# Altium schematic sheet TSAL.SchDoc
size A4; SheetNumber: 9; SheetTotal: 11
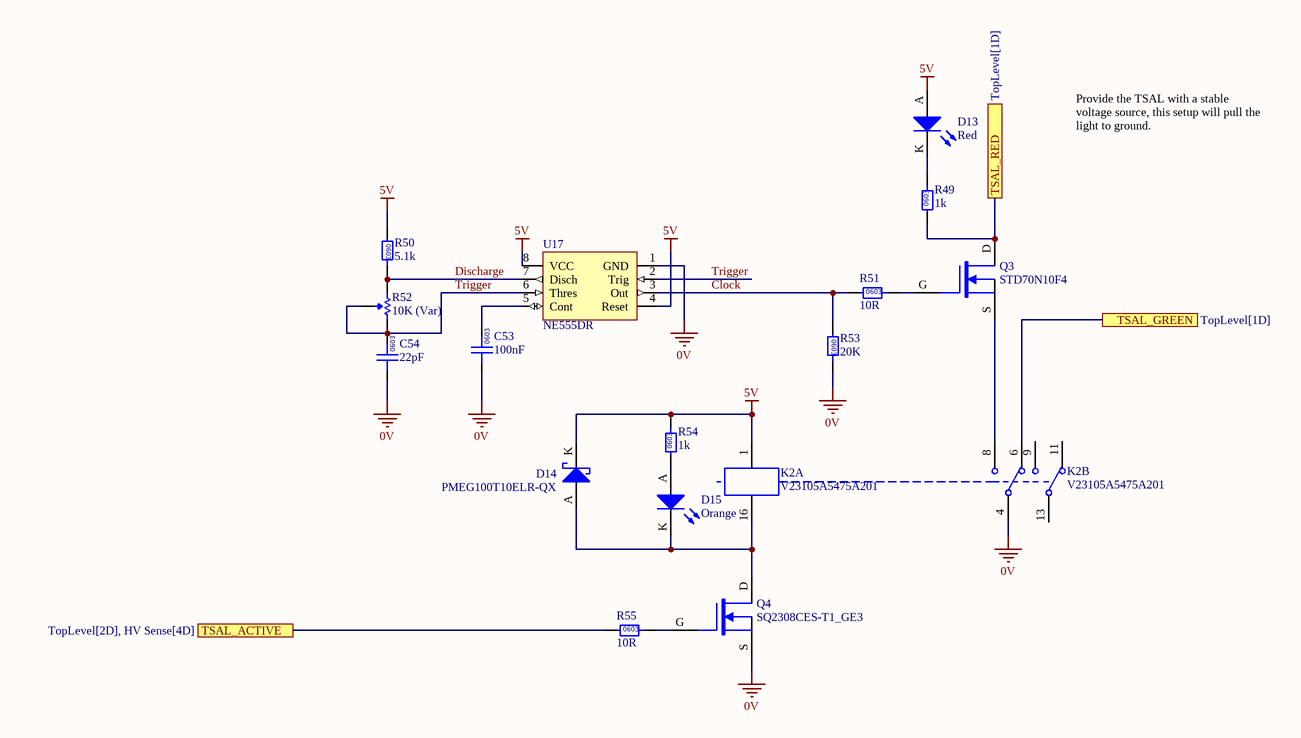
[diagram p0: TSAL.SchDoc]

## Parts
C53  100nF  [0603]
C54  22pF  [0603]
D13  Red  [0805 LED]
D14  PMEG100T10ELR-QX  [NXP SOD123W]
D15  Orange  [0805 LED]
K2  V23105A5475A201  [TI 2-DIL]  (parts A,B of 2)
Q3  STD70N10F4  [STM TO-252 MOSFET]
Q4  SQ2308CES-T1_GE3  [VSHY SOT-23-3]
R49  1k  [0603]
R50  5.1k  [0603]
R51  10R  [0603]
R52  10K (Var)  [B 3296]
R53  20K  [0603]
R54  1k  [0603]
R55  10R  [0603]
U17  NE555DR  [TI 8-SOIC]

## Ports
TSAL_ACTIVE (see TopLevel[2D], HV Sense[4D]), TSAL_GREEN (see TopLevel[1D]), TSAL_RED (see TopLevel[1D])

## Nets
0V: C53.1 C54.1 K2.4 Q4.S R53.2 U17.1(GND)
5V: D13.A D14.K K2.1 R50.1 R54.2 U17.4(Reset) U17.8(VCC)
Clock: R51.1 R53.1 U17.3(Out)
Discharge: R50.2 R52.3(CW) U17.7(Disch)
Trigger: C54.2 R52.1(CCW) R52.2(Wiper) U17.2(Trig) U17.6(Thres)
TSAL_ACTIVE: R55.1 ; port TSAL_ACTIVE
TSAL_GREEN: K2.6 ; port TSAL_GREEN
TSAL_RED: Q3.D R49.1 ; port TSAL_RED
NetC53_2: C53.2 U17.5(Cont)
NetD13_K: D13.K R49.2
NetD14_A: D14.A D15.K K2.16 Q4.D
NetD15_A: D15.A R54.1
NetK2_8: K2.8 Q3.S
NetQ3_G: Q3.G R51.2
NetQ4_G: Q4.G R55.2

Not connected (* = marked no-connect by the designer): K2 9 11 13

## Notes on the sheet
- Provide the TSAL with a stable voltage source, this setup will pull the light to ground.
- (in symbol GCM188L81H104KA57D) 0603
- (in symbol GRM0335C1H220JA01D) 0603
- (in symbol RC0603FR-071KL) 0603
- (in symbol RC0603FR-0710RL) 0603
- (in symbol RC0603FR-0720KL) 0603
- (in symbol RC0603JR-075K1L) 0603

## Library data of the parts
C53 = GCM188L81H104KA57D: Manufacturer: muRata; Rated Voltage: 50V; Tolerance: ±10%; Material: MLCC; Temperature Rating: X8L; Part Number: GCM188L81H104KA57D; Value: 100nF; Digikey Part Number: 490-6049-1-ND
C54 = GRM0335C1H220JA01D: Manufacturer: Murata Electronics; Rated Voltage: 50V; Tolerance: ±5%; Material: MLCC; Temperature Rating: C0G, NP0; Part Number: GRM0335C1H220JA01D; Value: 22pF; Digikey Part Number: 490-6123-1-ND
D13 = SML-210LTT86: Red LED Indication - Discrete 1.75V 0805 (2012 Metric); Manufacturer: ROHM Semiconductor; Part Number: SML-210LTT86; Colour: Red; Digikey Part Number: 511-1286-1-ND
D14 = PMEG100T10ELR-QX: Manufacturer: Nexperia USA Inc.; Forward Voltage: 0.75 V @ 1A; Breakdown Voltage: 100 V; Rated Power: 680 mW; Part Number: PMEG100T10ELR-QX; Digikey Part Number: 1727-PMEG100T10ELR-QXCT-ND
D15 = SML-211DTT86: Orange LED Indication - Discrete 1.75V 0805 (2012 Metric); Manufacturer: ROHM Semiconductor; Part Number: SML-211DTT86; Colour: Orange; Digikey Part Number: 511-1291-1-ND
K2 = CMP-036-000001-1: 5V DPDT Relay 3A 220VDC; Part Number: V23105A5475A201
Q3 = STD70N10F4: N-Channel 100V 60A (Tc) 125W (Tc) Surface Mount DPAK; Manufacturer: STMicroelectronics; Published: 24-Mar-1999; LatestRevisionDate: 29-May-2009; LatestRevisionNote: IPC-7351 Footprint Added.; PackageVersion: Sep-2000; PackageReference: SOT-343; Publisher: Altium Limited; PackageDescription: 4-Pin SOT-343 Package 1.3 mm Pitch, 2.1 mm Lead Span; Part Number: STD70N10F4; Type: N-channel; Rated Power: 125W; Digikey Part Number: 497-8806-2-ND
Q4 = SQ2308CES-T1_GE3: MOSFET N-CH 60V 2.3A SOT23; Manufacturer: Vishay Siliconix; Type: N-channel; Rated Power: 2W; Published: 24-Mar-1999; LatestRevisionDate: 29-May-2009; LatestRevisionNote: IPC-7351 Footprint Added.; PackageVersion: Sep-2000; PackageReference: SOT-343; Publisher: Altium Limited; PackageDescription: 4-Pin SOT-343 Package 1.3 mm Pitch, 2.1 mm Lead Span; Part Number: SQ2308CES-T1_GE3; Digikey Part Number: SQ2308CES-T1_GE3CT-ND
R49 R54 = RC0603FR-071KL: Manufacturer: YAGEO; Tolerance: 0.01; Rated Power: 0.1W; Part Number: RC0603FR-071KL; Value: 1k; Material: FR-07; Digikey Part Number: 311-1.00KHRCT-ND
R50 = RC0603JR-075K1L: Manufacturer: YAGEO; Tolerance: 0.01; Rated Power: 0.1W; Part Number: RC0603JR-075K1L; Value: 5.1k; Material: FR-07; Digikey Part Number: 311-5.1KGRCT-ND
R51 R55 = RC0603FR-0710RL: Manufacturer: YAGEO; Tolerance: 0.01; Rated Power: 0.1W; Part Number: RC0603FR-0710RL; Value: 10R; Material: FR-07; Digikey Part Number: 311-10.0HRCT-ND
R52 = 3296W-1-103LF: Manufacturer: Bournes Inc; Tolerance: 0.1; Rated Power: 0.5W; Part Number: 3296W-1-103LF; Value: 10K (Var); Digikey Part Number: 3296W-103LF-ND
R53 = RC0603FR-0720KL: Manufacturer: YAGEO; Tolerance: 0.01; Rated Power: 0.1W; Part Number: RC0603FR-0720KL; Value: 20K; Material: FR-07; Digikey Part Number: 311-20.0KHRCT-ND
U17 = CMP-022-000003-1: IC OSC SGL TIMER 100KHZ 8-SOIC; Part Number: NE555DR